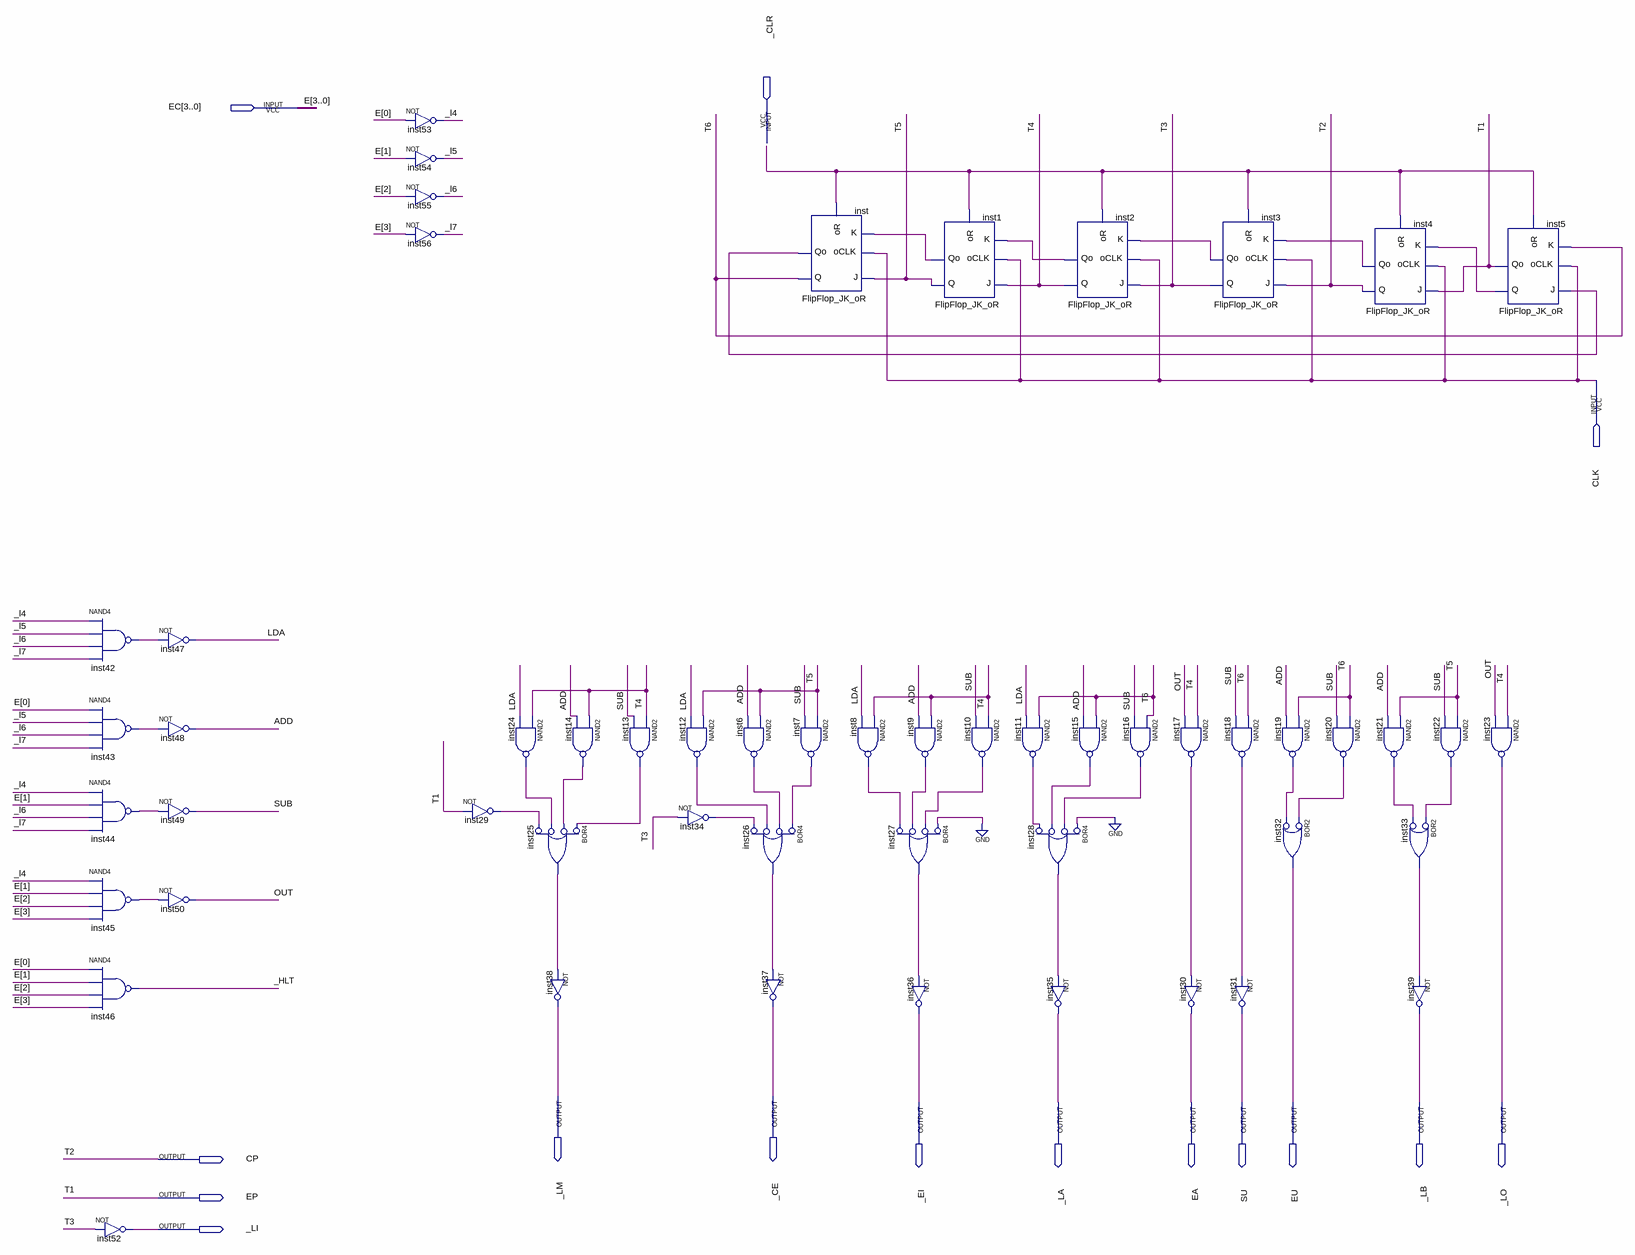
[diagram p0: schematic sheet]
// Quartus schematic Controlador_Sequencializador.bdf as structural Verilog: 54 symbols, 15 pins
module Controlador_Sequencializador (
  input  [3:0] EC,
  input  _CLR,
  input  CLK,
  output _LM,
  output _CE,
  output _EI,
  output _LA,
  output EA,
  output SU,
  output EU,
  output _LB,
  output _LO,
  output CP,
  output EP,
  output _LI
);

  wire _HLT, _l4, _l5, _l6, _l7, ADD, inst1_qo, inst2_qo, inst3_qo, inst4_qo, inst5_q, inst6_out, inst7_out,
       inst8_out, inst9_out, inst10_out, inst11_out, inst12_out, inst13_out, inst14_out, inst15_out,
       inst16_out, inst17_out, inst18_out, inst19_out, inst20_out, inst21_out, inst22_out, inst24_out,
       inst25_out, inst26_out, inst27_out, inst28_out, inst29_out, inst33_out, inst34_out, inst42_out,
       inst43_out, inst44_out, inst45_out, inst_qo, LDA, OUT, SUB, T3, T4, T5, T6;

  nand inst42 (inst42_out, _l4, _l5, _l6, _l7);
  nand inst43 (inst43_out, EC[0], _l5, _l6, _l7);
  nand inst44 (inst44_out, _l4, EC[1], _l6, _l7);
  nand inst45 (inst45_out, _l4, EC[1], EC[2], EC[3]);
  nand inst46 (_HLT, EC[0], EC[1], EC[2], EC[3]);
  not inst52 (_LI, T3);
  not inst47 (LDA, inst42_out);
  not inst48 (ADD, inst43_out);
  not inst49 (SUB, inst44_out);
  not inst50 (OUT, inst45_out);
  not inst53 (_l4, EC[0]);
  not inst54 (_l5, EC[1]);
  not inst55 (_l6, EC[2]);
  not inst56 (_l7, EC[3]);
  not inst29 (inst29_out, EP);
  nand inst24 (inst24_out, T4, LDA);
  nand inst14 (inst14_out, T4, ADD);
  or inst25 (inst25_out, ~inst13_out, ~inst14_out, ~inst24_out, ~inst29_out);  // BOR4
  not inst38 (_LM, inst25_out);
  nand inst13 (inst13_out, T4, SUB);
  nand inst12 (inst12_out, T5, LDA);
  not inst34 (inst34_out, T3);
  nand inst6 (inst6_out, T5, ADD);
  or inst26 (inst26_out, ~inst7_out, ~inst6_out, ~inst12_out, ~inst34_out);  // BOR4
  not inst37 (_CE, inst26_out);
  FlipFlop_JK_oR inst (.J(T5), .oCLK(CLK), .K(inst1_qo), .oR(_CLR), .Q(T6), .Qo(inst_qo));
  nand inst7 (inst7_out, T5, SUB);
  nand inst8 (inst8_out, T4, LDA);
  nand inst9 (inst9_out, T4, ADD);
  or inst27 (inst27_out, ~1'b0, ~inst10_out, ~inst9_out, ~inst8_out);  // BOR4
  not inst36 (_EI, inst27_out);
  FlipFlop_JK_oR inst1 (.J(T4), .oCLK(CLK), .K(inst2_qo), .oR(_CLR), .Q(T5), .Qo(inst1_qo));
  nand inst10 (inst10_out, T4, SUB);
  nand inst11 (inst11_out, T6, LDA);
  FlipFlop_JK_oR inst2 (.J(T3), .oCLK(CLK), .K(inst3_qo), .oR(_CLR), .Q(T4), .Qo(inst2_qo));
  nand inst15 (inst15_out, T6, ADD);
  or inst28 (inst28_out, ~1'b0, ~inst16_out, ~inst15_out, ~inst11_out);  // BOR4
  not inst35 (_LA, inst28_out);
  nand inst16 (inst16_out, T6, SUB);
  nand inst17 (inst17_out, T4, OUT);
  FlipFlop_JK_oR inst3 (.J(CP), .oCLK(CLK), .K(inst4_qo), .oR(_CLR), .Q(T3), .Qo(inst3_qo));
  nand inst18 (inst18_out, T6, SUB);
  not inst30 (EA, inst17_out);
  nand inst19 (inst19_out, T6, ADD);
  or inst32 (EU, ~inst20_out, ~inst19_out);  // BOR2
  not inst31 (SU, inst18_out);
  nand inst20 (inst20_out, T6, SUB);
  FlipFlop_JK_oR inst4 (.J(EP), .oCLK(CLK), .K(inst5_q), .oR(_CLR), .Q(CP), .Qo(inst4_qo));
  nand inst21 (inst21_out, T5, ADD);
  or inst33 (inst33_out, ~inst22_out, ~inst21_out);  // BOR2
  not inst39 (_LB, inst33_out);
  nand inst22 (inst22_out, T5, SUB);
  FlipFlop_JK_oR inst5 (.J(inst_qo), .oCLK(CLK), .K(T6), .oR(_CLR), .Q(inst5_q), .Qo(EP));
  nand inst23 (_LO, T4, OUT);

  // Other names for the same wires on the sheet: E[3:0] = EC; T1 = EP; T2 = CP
endmodule
